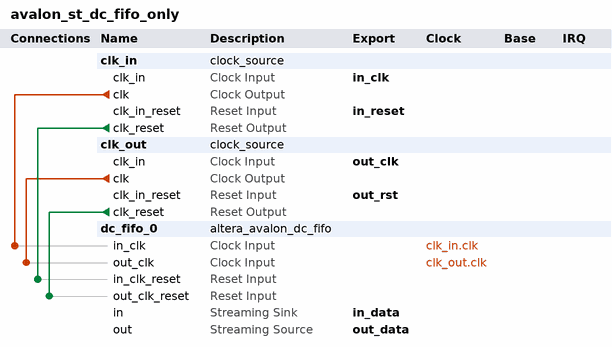
[diagram p0: system contents]
# Platform Designer (Qsys) system avalon_st_dc_fifo_only, Stratix IV EP4SGX230KF40C2
# Parameters at their usual value, and those the tool derives, are not listed.
package require -exact qsys 12.1
create_system avalon_st_dc_fifo_only
set_project_property DEVICE_FAMILY {Stratix IV}
set_project_property DEVICE EP4SGX230KF40C2

add_instance clk_in clock_source 12.1
set_instance_parameter_value clk_in clockFrequency 25000000

add_instance clk_out clock_source 12.1
set_instance_parameter_value clk_out clockFrequency 100000000

add_instance dc_fifo_0 altera_avalon_dc_fifo 12.1
set_instance_parameter_value dc_fifo_0 SYMBOLS_PER_BEAT 4
set_instance_parameter_value dc_fifo_0 BITS_PER_SYMBOL 8
set_instance_parameter_value dc_fifo_0 FIFO_DEPTH 4096
set_instance_parameter_value dc_fifo_0 USE_PACKETS 1

# connections
add_connection clk_in.clk dc_fifo_0.in_clk clock
add_connection clk_out.clk dc_fifo_0.out_clk clock
add_connection clk_in.clk_reset dc_fifo_0.in_clk_reset reset
add_connection clk_out.clk_reset dc_fifo_0.out_clk_reset reset

# exported interfaces
add_interface in_clk clock sink
set_interface_property in_clk EXPORT_OF clk_in.clk_in
add_interface in_reset reset sink
set_interface_property in_reset EXPORT_OF clk_in.clk_in_reset
add_interface in_data avalon_streaming sink
set_interface_property in_data EXPORT_OF dc_fifo_0.in
add_interface out_data avalon_streaming source
set_interface_property out_data EXPORT_OF dc_fifo_0.out
add_interface out_clk clock sink
set_interface_property out_clk EXPORT_OF clk_out.clk_in
add_interface out_rst reset sink
set_interface_property out_rst EXPORT_OF clk_out.clk_in_reset

save_system avalon_st_dc_fifo_only.qsys
